# Altium schematic sheet Power.SchDoc: =project_title
size Tabloid; PageSetup: Record=PageOptions|CenterHorizontal=True|CenterVertical=True|PrintScale=0.73|XCorrection=1.00|YCorrection=1.00|PrintKind=0|BorderSize=5000000|LeftOffset=0|BottomOffset=0|Orientation=2|PaperLength=1000|PaperWidth=1000|Scale=100|PaperSource=7|PrintQuality=-4|MediaType=1|DitherType=10|PaperKind=A4|PrintScaleMode=1; CompanyName: Luxonis Holding; Organization: Luxonis Holding; Address1: 1925 Harmony Park Drive; Address2: Westminster, CO; Address3: 80234; Address4: United States; SheetNumber: 1; SheetTotal: 2
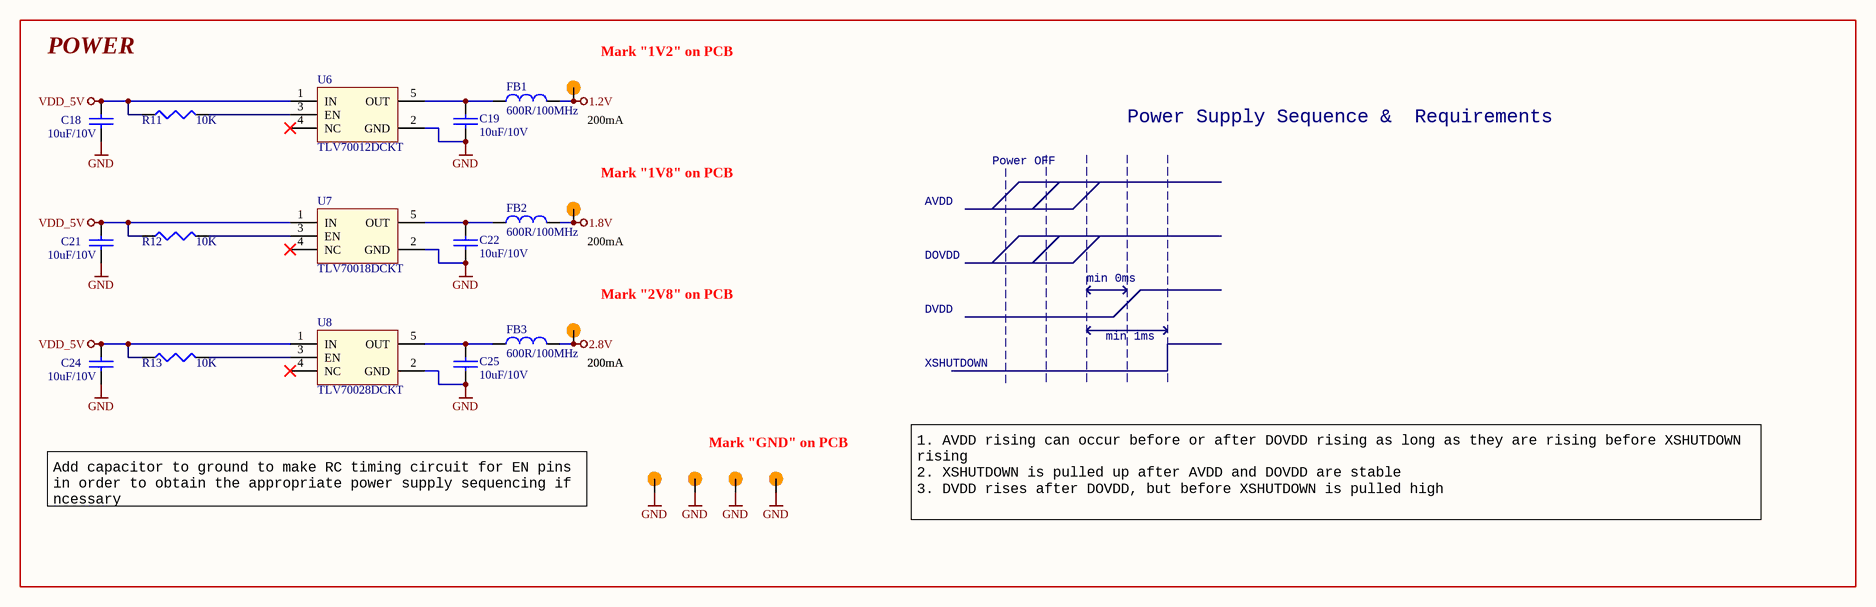
[diagram p0: Power.SchDoc]

## Parts
C18  10uF/10V  [0603]
C19  10uF/10V  [0603]
C21  10uF/10V  [0603]
C22  10uF/10V  [0603]
C24  10uF/10V  [0603]
C25  10uF/10V  [0603]
FB1  600R/100MHz  [0805]
FB2  600R/100MHz  [0805]
FB3  600R/100MHz  [0805]
R11  10K  [0603]
R12  10K  [0603]
R13  10K  [0603]
TP7  TP_SMD  [TP_0.75MM_SMD_NO-SILK]  (value not drawn)  (no BOM)
TP8  TP_SMD  [TP_0.75MM_SMD_NO-SILK]  (value not drawn)  (no BOM)
TP9  TP_SMD  [TP_0.75MM_SMD_NO-SILK]  (value not drawn)  (no BOM)
TP10  TP_SMD  [TP_0.75MM_SMD_NO-SILK]  (value not drawn)  (no BOM)
TP11  TP_SMD  [TP_0.75MM_SMD_NO-SILK]  (value not drawn)  (no BOM)
TP12  TP_SMD  [TP_0.75MM_SMD_NO-SILK]  (value not drawn)  (no BOM)
TP13  TP_SMD  [TP_0.75MM_SMD_NO-SILK]  (value not drawn)  (no BOM)
U6  TLV70012DCKT  [SC70-5]
U7  TLV70018DCKT  [SC70-5]
U8  TLV70028DCKT  [SC70-5]

## Nets
1.2V: FB1.2 TP7.1
1.8V: FB2.2 TP8.1
2.8V: FB3.2 TP9.1
GND: C18.2 C19.2 C21.2 C22.2 C24.2 C25.2 TP10.1 TP11.1 TP12.1 TP13.1 U6.2(GND) U7.2(GND) U8.2(GND)
VDD_5V: C18.1 C21.1 C24.1 R11.1 R12.1 R13.1 U6.1(IN) U7.1(IN) U8.1(IN)
NetC19_1: C19.1 FB1.1 U6.5(OUT)
NetC22_1: C22.1 FB2.1 U7.5(OUT)
NetC25_1: C25.1 FB3.1 U8.5(OUT)
NetR11_2: R11.2 U6.3(EN)
NetR12_2: R12.2 U7.3(EN)
NetR13_2: R13.2 U8.3(EN)

Not connected (* = marked no-connect by the designer): U6 4(NC)*; U7 4(NC)*; U8 4(NC)*

## Notes on the sheet
- POWER
- (near TP7) Mark "1V2" on PCB
- 200mA
- (near TP8) Mark "1V8" on PCB
- Power OFF
- Power Supply Sequence &  Requirements
- AVDD
- (near TP9) Mark "2V8" on PCB
- DOVDD
- DVDD
- min 0ms
- XSHUTDOWN
- min 1ms
- Mark "GND" on PCB
- Add capacitor to ground to make RC timing circuit for EN pins in order to obtain the appropriate power supply sequencing if ncessary
- 1. AVDD rising can occur before or after DOVDD rising as long as they are rising before XSHUTDOWN rising
  2. XSHUTDOWN is pulled up after AVDD and DOVDD are stable
  3. DVDD rises after DOVDD, but before XSHUTDOWN is pulled high
- Title
- Size:
- Date:
- Tabloid
- Number:
- Time:
- Revision:
- Sheet
- of
- Drawn by:

## Library data of the parts
C18 C19 C21 C22 C24 C25 = CAP: CC0603MRX5R5BB106  SMD Multilayer Ceramic Capacitor, 0603 [1608 Metric], 10 µF, 6.3 V, ± 20%, X5R; MAN: Yageo(PHYCOM); ICCO PN: MV122009; DIST: Farnell; DIST PN: 1458902; MAN PN: CC0603MRX5R5BB106
FB1-FB3 = INDUCTANCE1: Ferrite Bead; MAN: FAIR-RITE; MAN PN: 2508056017Y2; ICCO PN: MV142024; DIST: Farnell; DIST PN: 1838838RL
R11-R13 = RES1: SMD Chip Resistor, 10 kohm, 75 V, 0603 [1608 Metric], 100 mW, ± 1%; MAN: Walsin; MAN PN: WR06X1002FTL; ICCO PN: MV122008; DIST: Farnell; DIST PN: 2502397
TP7-TP13 = TP_SMD: circular pad test point, SMD
U6 = TLV70012DCKT: LDO, 200MA, 1.2V, 5SC70; MAN: TI; DIST PN: 2437498; DIST: Farnell; ICCO PN: MV250001; MAN PN: TLV70012DCKT
U7 = TLV70018DCKT: LDO, 200MA, 1.8V, 5SC70; MAN: TI; DIST PN: 1778221; DIST: Farnell; ICCO PN: MV198003; MAN PN: TLV70018DCKT
U8 = TLV70028DCKT: LDO, 200MA, 2.8V, 5SC70; MAN: TI; DIST PN: 1778222; DIST: Farnell; ICCO PN: MV250002; MAN PN: TLV70028DCKT